# EAGLE design RP_MODE01 (EAGLE 9.6.2)
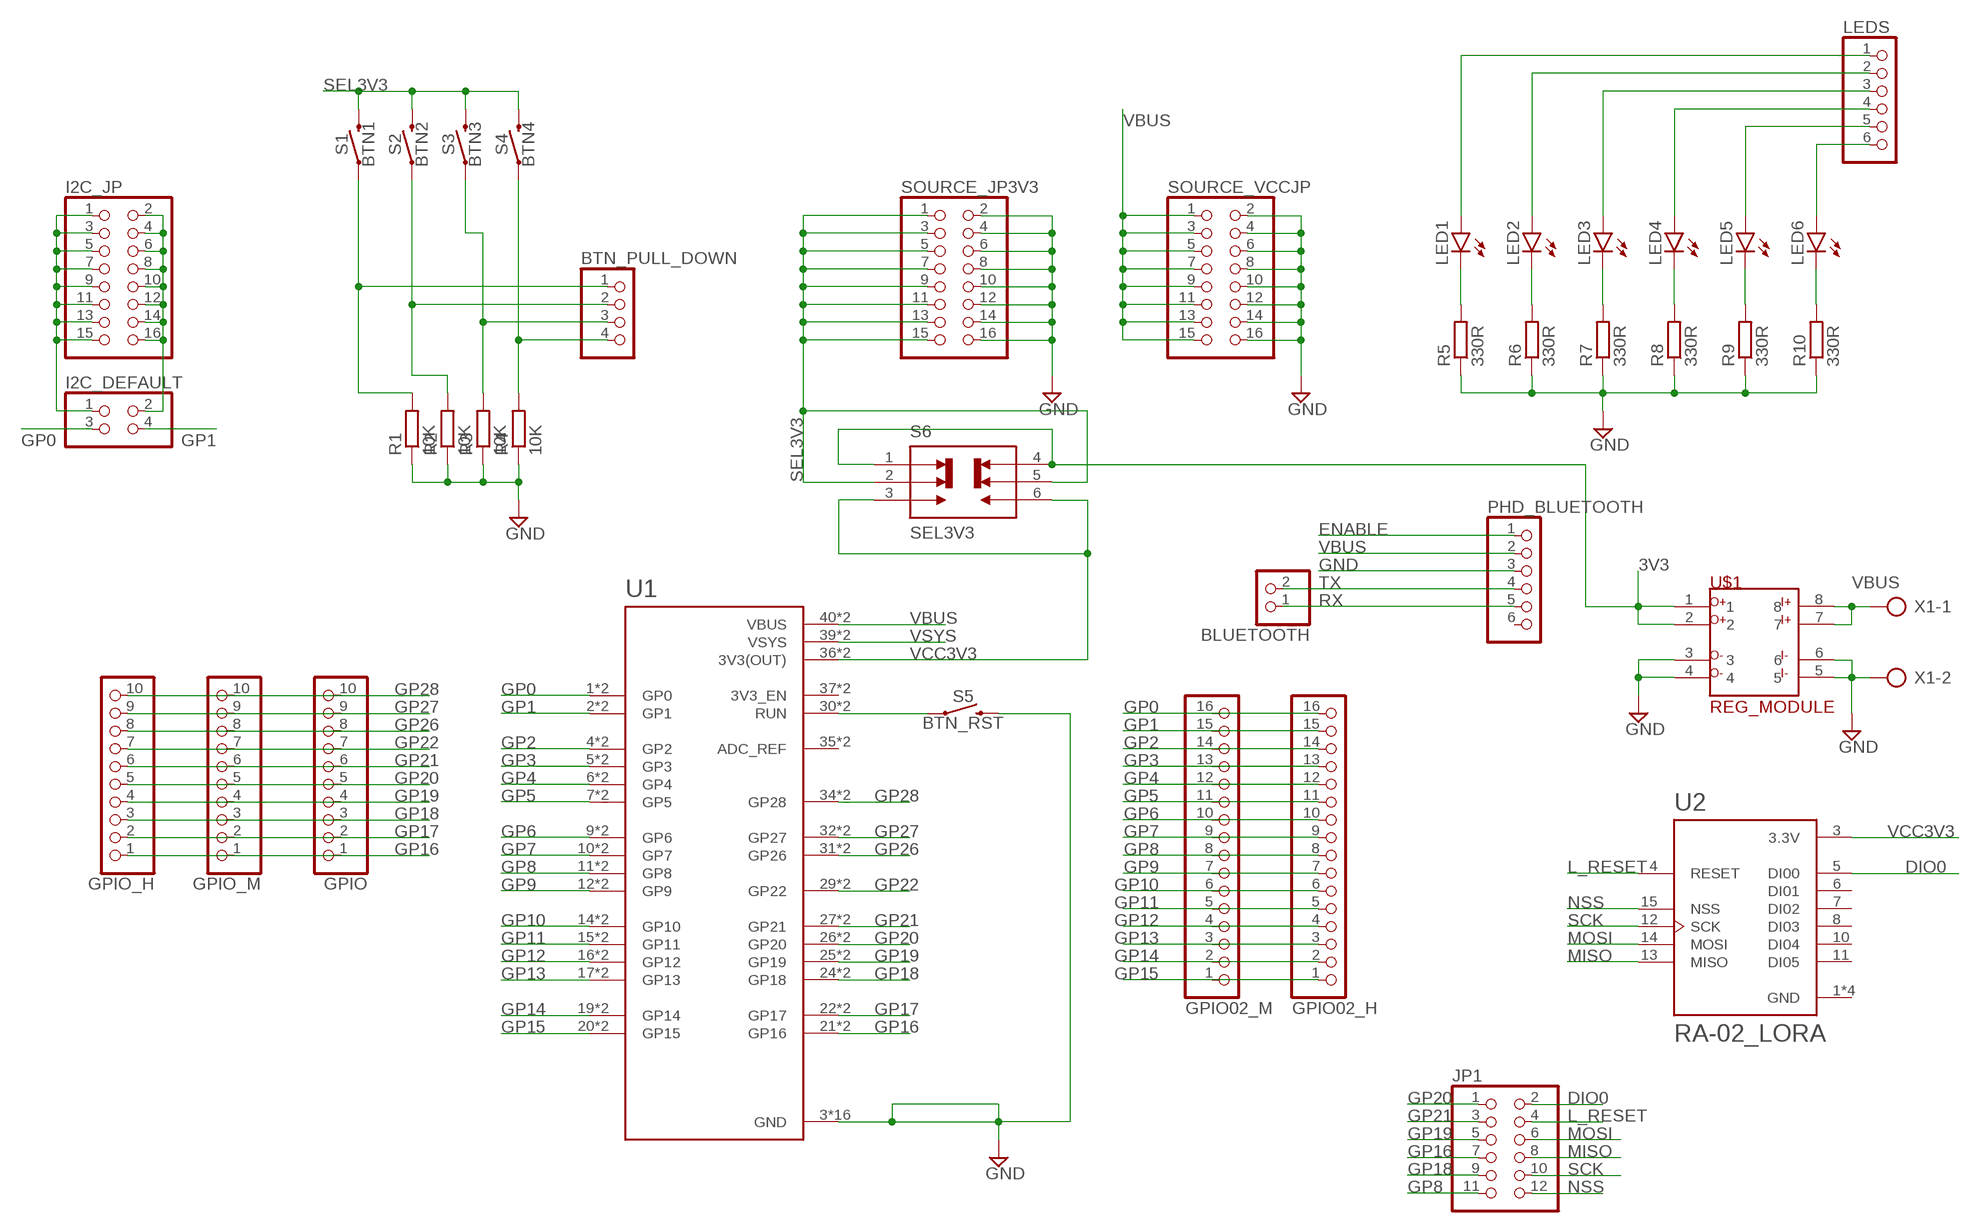
[diagram p0: schematic, sheet 1]

## Parts
BLUETOOTH  PINHD-1X2  [1X02]
BTN_PULL_DOWN  PINHD-1X4  [1X04]
GPIO  PINHD-1X10  [1X10]
GPIO02_H  PINHD-1X16  [1X16]
GPIO02_M  PINHD-1X16  [1X16]
GPIO_H  PINHD-1X10  [1X10]
GPIO_M  PINHD-1X10  [1X10]
I2C_DEFAULT  PINHD-2X2  [2X02]
I2C_JP  PINHD-2X8  [2X08]
JP1  PINHD-2X6  [2X06]
LED1  LEDCHIP-LED0805  [CHIP-LED0805]
LED2  LEDCHIP-LED0805  [CHIP-LED0805]
LED3  LEDCHIP-LED0805  [CHIP-LED0805]
LED4  LEDCHIP-LED0805  [CHIP-LED0805]
LED5  LEDCHIP-LED0805  [CHIP-LED0805]
LED6  LEDCHIP-LED0805  [CHIP-LED0805]
LEDS  PINHD-1X6  [1X06]
PHD_BLUETOOTH  PINHD-1X6  [1X06]
R1  10K  R-EU_R0805  [R0805]
R2  10K  R-EU_R0805  [R0805]
R3  10K  R-EU_R0805  [R0805]
R4  10K  R-EU_R0805  [R0805]
R5  330R  R-EU_R0805  [R0805]
R6  330R  R-EU_R0805  [R0805]
R7  330R  R-EU_R0805  [R0805]
R8  330R  R-EU_R0805  [R0805]
R9  330R  R-EU_R0805  [R0805]
R10  330R  R-EU_R0805  [R0805]
S1  BTN1  PTS636SM25FSMTRLFS-SMD-6.0X3.5MM  [TACTILE_SWITCH_SMD_6.0X3.5MM]
S2  BTN2  PTS636SM25FSMTRLFS-SMD-6.0X3.5MM  [TACTILE_SWITCH_SMD_6.0X3.5MM]
S3  BTN3  PTS636SM25FSMTRLFS-SMD-6.0X3.5MM  [TACTILE_SWITCH_SMD_6.0X3.5MM]
S4  BTN4  PTS636SM25FSMTRLFS-SMD-6.0X3.5MM  [TACTILE_SWITCH_SMD_6.0X3.5MM]
S5  BTN_RST  PTS636SM25FSMTRLFS-SMD-6.0X3.5MM  [TACTILE_SWITCH_SMD_6.0X3.5MM]
S6  SEL3V3  JS202011SCQN  [SW_JS202011SCQN]
SOURCE_JP3V3  PINHD-2X8  [2X08]
SOURCE_VCCJP  PINHD-2X8  [2X08]
U1  RASPBERRY_PICO-NO_DEBUG  [PICO-PKG-NO_DEBUG]
U2  RA-02_LORA  [MODULE_RA-02_LORA]
U$1  REG_MODULE  [REG_MODULE]
X1  AK300/2  [AK300/2]

## Nets
3V3: S6.1 S6.4 U$1.1 U$1.2
DIO0: JP1.2 U2.5(DI00)
ENABLE: PHD_BLUETOOTH.1
GND: PHD_BLUETOOTH.3 R1.1 R2.1 R3.1 R4.1 R5.1 R6.1 R7.1 R8.1 R9.1 R10.1 S5.2 SOURCE_JP3V3.2 SOURCE_JP3V3.4 SOURCE_JP3V3.6 SOURCE_JP3V3.8 SOURCE_JP3V3.10 SOURCE_JP3V3.12 SOURCE_JP3V3.14 SOURCE_JP3V3.16 SOURCE_VCCJP.2 SOURCE_VCCJP.4 SOURCE_VCCJP.6 SOURCE_VCCJP.8 SOURCE_VCCJP.10 SOURCE_VCCJP.12 SOURCE_VCCJP.14 SOURCE_VCCJP.16 U1.3(GND) U1.8(GND) U1.13(GND) U1.18(GND) U1.23(GND) U1.28(GND) U1.33(GND) U1.38(GND) U1.P$3(GND) U1.P$8(GND) U1.P$13(GND) U1.P$18(GND) U1.P$23(GND) U1.P$28(GND) U1.P$33(GND) U1.P$38(GND) U$1.3 U$1.4 U$1.5 U$1.6 X1.2
GP0: GPIO02_H.16 GPIO02_M.16 I2C_DEFAULT.3 U1.1(GP0) U1.P$1(GP0)
GP1: GPIO02_H.15 GPIO02_M.15 I2C_DEFAULT.4 U1.2(GP1) U1.P$2(GP1)
GP2: GPIO02_H.14 GPIO02_M.14 U1.4(GP2) U1.P$4(GP2)
GP3: GPIO02_H.13 GPIO02_M.13 U1.5(GP3) U1.P$5(GP3)
GP4: GPIO02_H.12 GPIO02_M.12 U1.6(GP4) U1.P$6(GP4)
GP5: GPIO02_H.11 GPIO02_M.11 U1.7(GP5) U1.P$7(GP5)
GP6: GPIO02_H.10 GPIO02_M.10 U1.9(GP6) U1.P$9(GP6)
GP7: GPIO02_H.9 GPIO02_M.9 U1.10(GP7) U1.P$10(GP7)
GP8: GPIO02_H.8 GPIO02_M.8 JP1.11 U1.11(GP8) U1.P$11(GP8)
GP9: GPIO02_H.7 GPIO02_M.7 U1.12(GP9) U1.P$12(GP9)
GP10: GPIO02_H.6 GPIO02_M.6 U1.14(GP10) U1.P$14(GP10)
GP11: GPIO02_H.5 GPIO02_M.5 U1.15(GP11) U1.P$15(GP11)
GP12: GPIO02_H.4 GPIO02_M.4 U1.16(GP12) U1.P$16(GP12)
GP13: GPIO02_H.3 GPIO02_M.3 U1.17(GP13) U1.P$17(GP13)
GP14: GPIO02_H.2 GPIO02_M.2 U1.19(GP14) U1.P$19(GP14)
GP15: GPIO02_H.1 GPIO02_M.1 U1.20(GP15) U1.P$20(GP15)
GP16: GPIO.1 GPIO_H.1 GPIO_M.1 JP1.7 U1.21(GP16) U1.P$21(GP16)
GP17: GPIO.2 GPIO_H.2 GPIO_M.2 U1.22(GP17) U1.P$22(GP17)
GP18: GPIO.3 GPIO_H.3 GPIO_M.3 JP1.9 U1.24(GP18) U1.P$24(GP18)
GP19: GPIO.4 GPIO_H.4 GPIO_M.4 JP1.5 U1.25(GP19) U1.P$25(GP19)
GP20: GPIO.5 GPIO_H.5 GPIO_M.5 JP1.1 U1.26(GP20) U1.P$26(GP20)
GP21: GPIO.6 GPIO_H.6 GPIO_M.6 JP1.3 U1.27(GP21) U1.P$27(GP21)
GP22: GPIO.7 GPIO_H.7 GPIO_M.7 U1.29(GP22) U1.P$29(GP22)
GP26: GPIO.8 GPIO_H.8 GPIO_M.8 U1.31(GP26) U1.P$31(GP26)
GP27: GPIO.9 GPIO_H.9 GPIO_M.9 U1.32(GP27) U1.P$32(GP27)
GP28: GPIO.10 GPIO_H.10 GPIO_M.10 U1.34(GP28) U1.P$34(GP28)
L_RESET: JP1.4 U2.4(RESET)
MISO: JP1.8 U2.13(MISO)
MOSI: JP1.6 U2.14(MOSI)
N$1: BTN_PULL_DOWN.1 R1.2 S1.1
N$2: BTN_PULL_DOWN.2 R2.2 S2.1
N$3: BTN_PULL_DOWN.3 R3.2 S3.1
N$4: BTN_PULL_DOWN.4 R4.2 S4.1
N$5: S5.1 U1.30(RUN) U1.P$30(RUN)
N$6: LED2.A LEDS.2
N$7: LED3.A LEDS.3
N$8: LED1.C R5.2
N$9: LED2.C R6.2
N$10: LED3.C R7.2
N$11: LED4.C R8.2
N$12: LED5.C R9.2
N$13: LED6.C R10.2
N$14: LED6.A LEDS.6
N$15: LED1.A LEDS.1
N$16: LED4.A LEDS.4
N$17: LED5.A LEDS.5
NSS: JP1.12 U2.15(NSS)
RX: BLUETOOTH.1 PHD_BLUETOOTH.5
SCK: JP1.10 U2.12(SCK)
SCL: I2C_DEFAULT.2 I2C_JP.2 I2C_JP.4 I2C_JP.6 I2C_JP.8 I2C_JP.10 I2C_JP.12 I2C_JP.14 I2C_JP.16
SDA: I2C_DEFAULT.1 I2C_JP.1 I2C_JP.3 I2C_JP.5 I2C_JP.7 I2C_JP.9 I2C_JP.11 I2C_JP.13 I2C_JP.15
SEL3V3: S1.2 S2.2 S3.2 S4.2 S6.2 S6.5 SOURCE_JP3V3.1 SOURCE_JP3V3.3 SOURCE_JP3V3.5 SOURCE_JP3V3.7 SOURCE_JP3V3.9 SOURCE_JP3V3.11 SOURCE_JP3V3.13 SOURCE_JP3V3.15
TX: BLUETOOTH.2 PHD_BLUETOOTH.4
VBUS: PHD_BLUETOOTH.2 SOURCE_VCCJP.1 SOURCE_VCCJP.3 SOURCE_VCCJP.5 SOURCE_VCCJP.7 SOURCE_VCCJP.9 SOURCE_VCCJP.11 SOURCE_VCCJP.13 SOURCE_VCCJP.15 U1.40(VBUS) U1.P$40(VBUS) U$1.7 U$1.8 X1.1
VCC3V3: S6.3 S6.6 U1.36(3V3(OUT)) U1.P$36(3V3(OUT)) U2.3(3.3V)
VSYS: U1.39(VSYS) U1.P$39(VSYS)
Unconnected: PHD_BLUETOOTH.6 U1.35(ADC_REF) U1.37(3V3_EN) U1.P$35(ADC_REF) U1.P$37(3V3_EN) U2.6(DI01) U2.7(DI02) U2.8(DI03) U2.10(DI04) U2.11(DI05)

## Power pins joined to a net without a drawn wire
GND: U2.1(GND) U2.2(GND) U2.9(GND) U2.16(GND)

## Library data of the parts
BLUETOOTH = pinhead:PINHD-1X2: PIN HEADER
BTN_PULL_DOWN = pinhead:PINHD-1X4: PIN HEADER
GPIO GPIO_H GPIO_M = pinhead:PINHD-1X10: PIN HEADER
GPIO02_H GPIO02_M = pinhead:PINHD-1X16: PIN HEADER
I2C_DEFAULT = pinhead:PINHD-2X2: PIN HEADER
I2C_JP SOURCE_JP3V3 SOURCE_VCCJP = pinhead:PINHD-2X8: PIN HEADER
JP1 = pinhead:PINHD-2X6: PIN HEADER
LED1-LED6 = led:LED: LED OSRAM: - CHIPLED LG R971, LG N971, LY N971, LG Q971, LY Q971, LO R971, LY R971 LH N974, LH R974 LS Q976, LO Q976, LY Q976 LO Q996 - Hyper CHIPLED LW Q18S LB Q993, LB Q99A, LB R99A - SideLED LS A670, LO A670, LY A670, LG A670, LP A670 LB A673, LV A673, LT A673, LW A673 LH A674 LY A675 LS A676, LA A676, LO A676, LY A676, LW A676 LS A679, LY A679, LG A679 - Hyper Micro SIDELED® LS Y876, LA Y876, LO Y876, LY Y876 LT Y87S - SmartLED LW L88C, LW L88S LB L89C, LB L89S, LG L890 LS L89K, LO L89K, LY L89K LS L896, LA L896, LO L896, LY L896 - TOPLED LS T670, LO T670, LY T670, LG T670, LP T670 LSG T670, LSP T670, LSY T670, LOP T670, LYG T670 LG T671, LOG T671, LSG T671 LB T673, LV T673, LT T673, LW T673 LH T674 LS T676, LA T676, LO T676, LY T676, LB T676, LH T676, LSB T676, LW T676 LB T67C, LV T67C, LT T67C, LS T67K, LO T67K, LY T67K, LW E67C LS E67B, LA E67B, LO E67B, LY E67B, LB E67C, LV E67C, LT E67C LW T67C LS T679, LY T679, LG T679 LS T770, LO T770, LY T770, LG T770, LP T770 LB T773, LV T773, LT T773, LW T773 LH T774 LS E675, LA E675, LY E675, LS T675 LS T776, LA T776, LO T776, LY T776, LB T776 LHGB T686 LT T68C, LB T68C - Hyper Mini TOPLED® LB M676 - Mini TOPLED Santana® LG M470 LS M47K, LO M47K, LY M47K Source: http://www.osram.convergy.de LUXEON: - LUMILED® LXK2-PW12-R00, LXK2-PW12-S00, LXK2-PW14-U00, LXK2-PW14-V00 LXK2-PM12-R00, LXK2-PM12-S00, LXK2-PM14-U00 LXK2-PE12-Q00, LXK2-PE12-R00, LXK2-PE12-S00, LXK2-PE14-T00, LXK2-PE14-U00 LXK2-PB12-K00, LXK2-PB12-L00, LXK2-PB12-M00, LXK2-PB14-N00, LXK2-PB14-P00, LXK2-PB14-Q00 LXK2-PR12-L00, LXK2-PR12-M00, LXK2-PR14-Q00, LXK2-PR14-R00 LXK2-PD12-Q00, LXK2-PD12-R00, LXK2-PD12-S00 LXK2-PH12-R00, LXK2-PH12-S00 LXK2-PL12-P00, LXK2-PL12-Q00, LXK2-PL12-R00 Source: www.luxeon.com KINGBRIGHT: KA-3528ASYC Source: www.kingbright.com
LEDS PHD_BLUETOOTH = pinhead:PINHD-1X6: PIN HEADER
R1-R10 = mi_rcl:R-EU_: RESISTOR, European symbol; SPICEPREFIX: R
S1-S5 = PTS636SM25FSMTRLFS:PTS636SM25FSMTRLFS: Momentary Switch (Pushbutton) - SPST Tactile Switch SPST-NO Top Actuated Surface Mount . Variants PTS636 SM25F SMTR LFS Momentary Pushbutton Switch - 12mm Square <https://www.snapeda.com/parts/PTS636%20SM25F%20SMTR%20LFS/C&K/datasheet/> PTS636 SM25F SMTR LFS Check availability <https://pricing.snapeda.com/parts/PTS636SM25FSMTRLFS/CK/view-part?ref=eda>; AVAILABILITY: In Stock; DESCRIPTION: Switch Tactile N.O. SPST Rectangular Button F-Lead 0.05A 12VDC 1.77N SMD T/R; MF: CK; MP: PTS636SM25FSMTRLFS; PACKAGE: None; PRICE: None
S6 = JS202011SCQN:JS202011SCQN: Check availability <https://pricing.snapeda.com/parts/JS202011SCQN/C%26K/view-part?ref=eda>; AVAILABILITY: In Stock; DESCRIPTION: Slide Switch DPDT Surface Mount; MF: C&K; MP: JS202011SCQN; PACKAGE: None; PRICE: None; PURCHASE-URL: https://pricing.snapeda.com/search?q=JS202011SCQN&ref=eda
U1 = RpiPico:RASPBERRY_PICO-NO_DEBUG
U2 = RA-02_LORA:RA-02_LORA: Ra-02 LoRa RF M5Stack Platform Evaluation Expansion Board Check availability <https://pricing.snapeda.com/parts/Ra-02%20LoRa/AI-Thinker/view-part?ref=eda>; AVAILABILITY: Not in stock; CHECK_PRICES: https://www.snapeda.com/parts/Ra-02%20LoRa/AI-Thinker/view-part/?ref=eda; DESCRIPTION: Ra-02 LoRa RF M5Stack Platform Evaluation Expansion Board; MF: AI-Thinker; MP: Ra-02 LoRa; PACKAGE: None; PRICE: None; SNAPEDA_LINK: https://www.snapeda.com/parts/Ra-02%20LoRa/AI-Thinker/view-part/?ref=snap
U$1 = REG_MODULE:REG_MODULE
X1 = con-ptr500:AK300/2: CONNECTOR; OC_FARNELL: unknown; OC_NEWARK: unknown

## Board
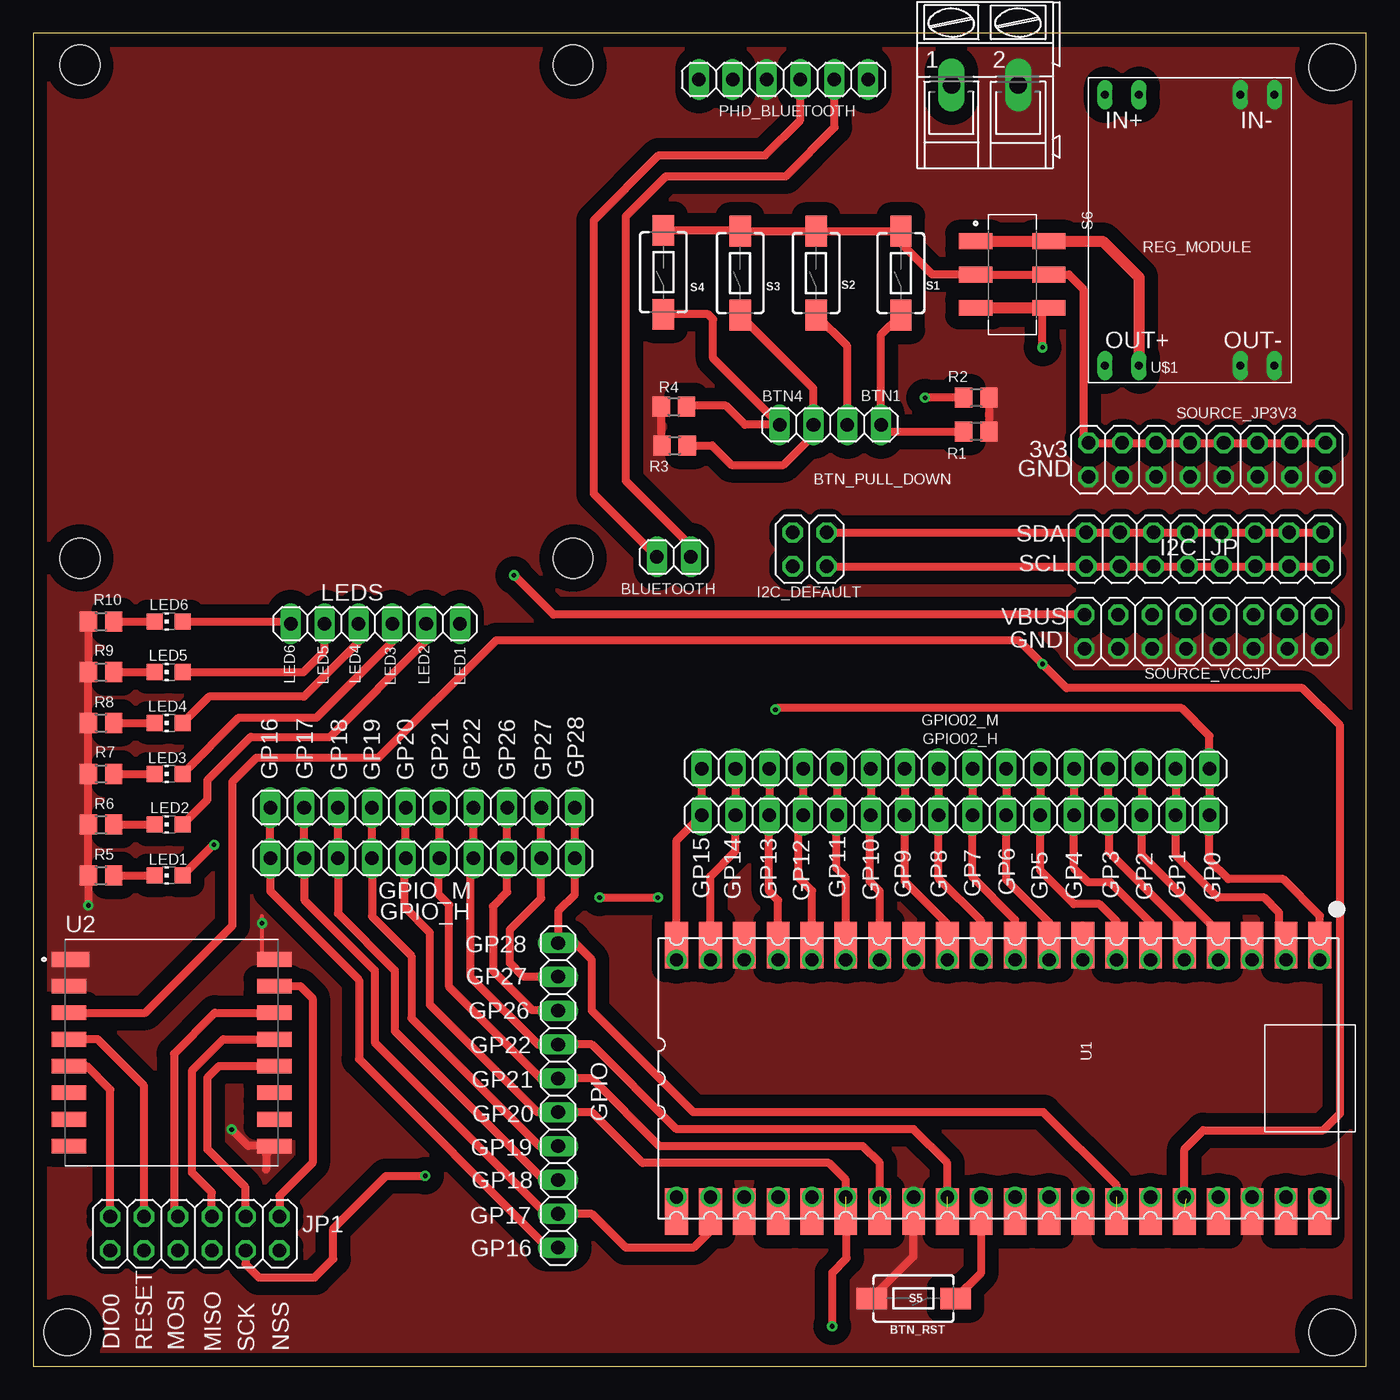
[diagram p1: board, top side]
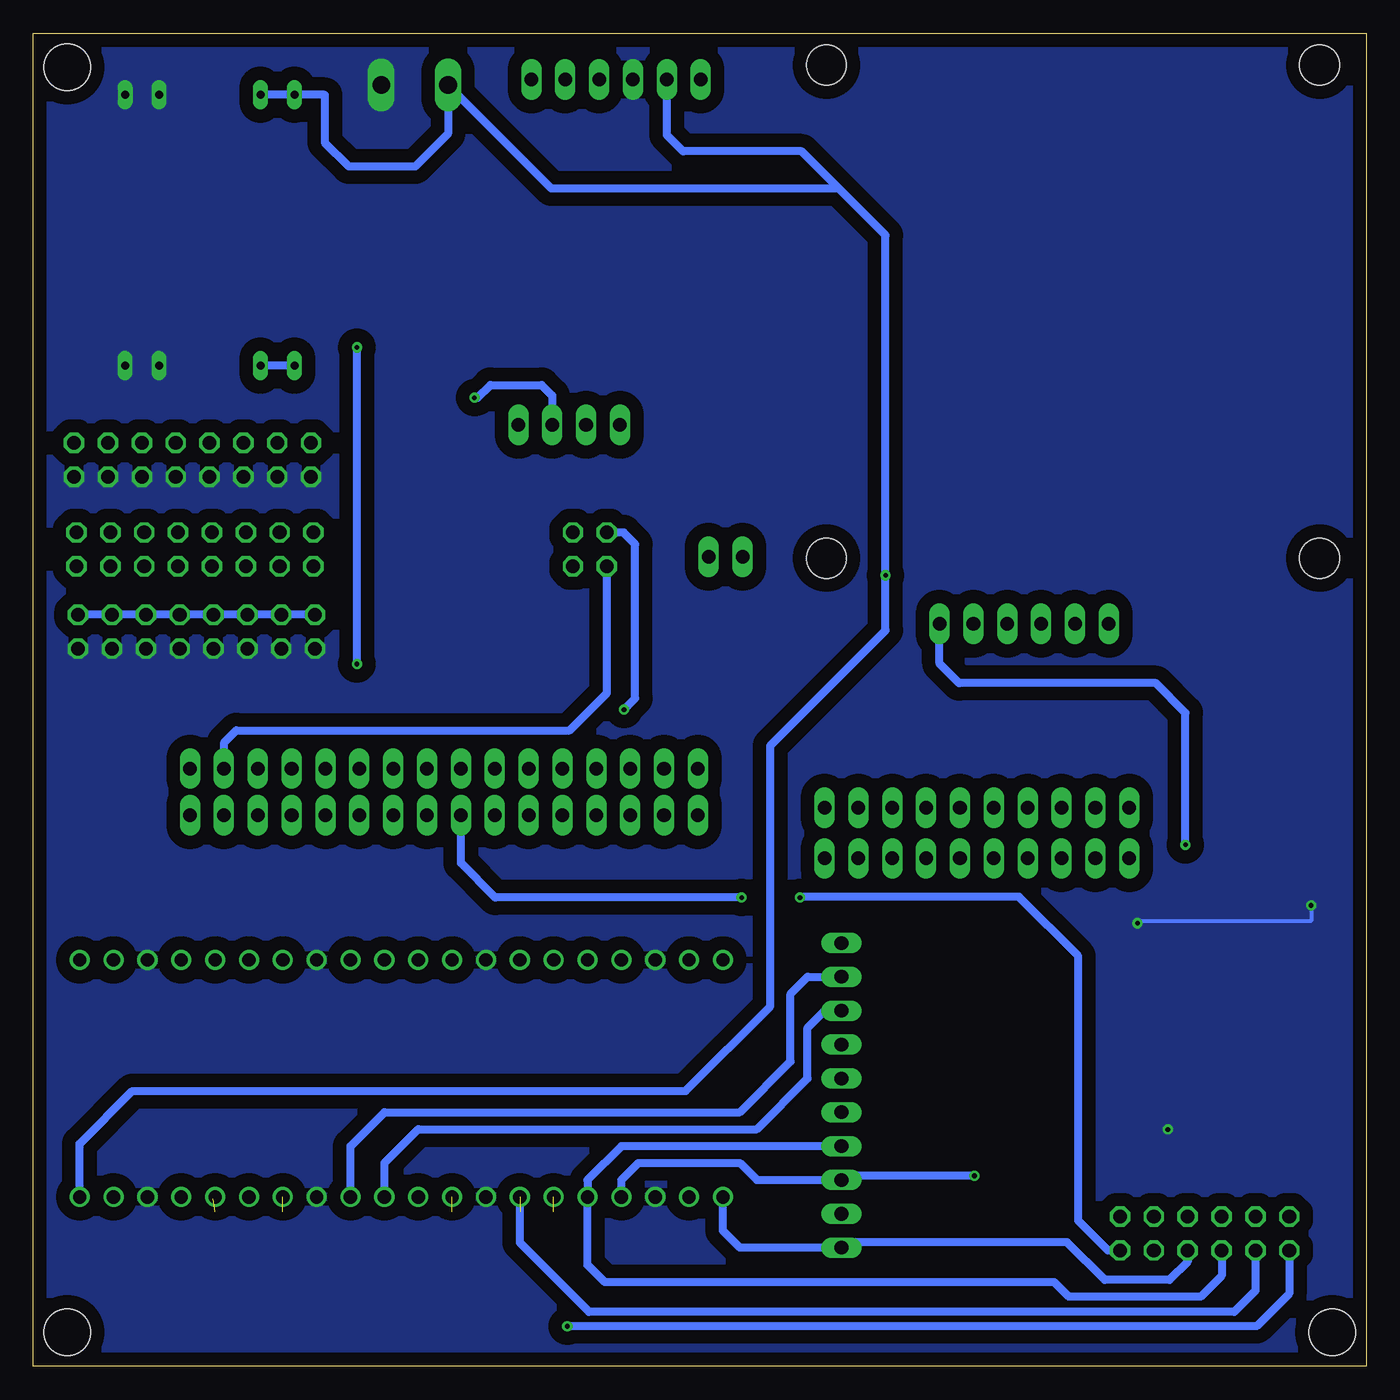
[diagram p2: board, bottom side, seen from below]

Size 100 x 100 mm. Coordinates in mm from the lower left corner, seen from the top.
Outline: 0,0 100,0 100,100 0,100 0,0
Copper layers (1*16): Top 0.035mm / dielectric 1.5mm / Bottom 0.035mm
Design rules "default *": minimum track width 6mil, minimum drill 0.35mm, track to track 6mil, track to pad 6mil, pad to pad 6mil, via to via 6mil, smd to smd 6mil, copper to edge 40mil, drill to drill 6mil, minimum pad ring 10mil, minimum via ring 8mil, stop-mask expansion 4mil, vias tented up to drill 0mil, thermal gap 0mil
Holes 3.5 mm at 2.54,2.54 97.46,2.54 97.46,97.46
Holes 3 mm at 3.49,97.62 3.49,60.62 40.49,97.62 40.49,60.62

### Footprints (pad centres in the part's own frame; a part is rotated, then mirrored left to right if it is on the bottom)
1X02 = drill 1.016 long: 1 -1.27,0; 2 1.27,0
1X04 = drill 1.016 long: 1 -3.81,0; 2 -1.27,0; 3 1.27,0; 4 3.81,0
1X10 = drill 1.016 long: 1 -11.43,0; 2 -8.89,0; 3 -6.35,0; 4 -3.81,0; 5 -1.27,0; 6 1.27,0; 7 3.81,0; 8 6.35,0; 9 8.89,0; 10 11.43,0
1X16 = drill 1.016 long: 1 -19.05,0; 2 -16.51,0; 3 -13.97,0; 4 -11.43,0; 5 -8.89,0; 6 -6.35,0; 7 -3.81,0; 8 -1.27,0; 9 1.27,0; 10 3.81,0; 11 6.35,0; 12 8.89,0; 13 11.43,0; 14 13.97,0; 15 16.51,0; 16 19.05,0
2X02 = drill 1.016 octagon: 1 -1.27,-1.27; 2 -1.27,1.27; 3 1.27,-1.27; 4 1.27,1.27
2X08 = drill 1.016 octagon: 1 -8.89,-1.27; 2 -8.89,1.27; 3 -6.35,-1.27; 4 -6.35,1.27; 5 -3.81,-1.27; 6 -3.81,1.27; 7 -1.27,-1.27; 8 -1.27,1.27; 9 1.27,-1.27; 10 1.27,1.27; 11 3.81,-1.27; 12 3.81,1.27; 13 6.35,-1.27; 14 6.35,1.27; 15 8.89,-1.27; 16 8.89,1.27
2X06 = drill 1.016 octagon: 1 -6.35,-1.27; 2 -6.35,1.27; 3 -3.81,-1.27; 4 -3.81,1.27; 5 -1.27,-1.27; 6 -1.27,1.27; 7 1.27,-1.27; 8 1.27,1.27; 9 3.81,-1.27; 10 3.81,1.27; 11 6.35,-1.27; 12 6.35,1.27
CHIP-LED0805 = smd 1.2 x 1.2: A 0,-1.05; C 0,1.05
1X06 = drill 1.016 long: 1 -6.35,0; 2 -3.81,0; 3 -1.27,0; 4 1.27,0; 5 3.81,0; 6 6.35,0
R0805 = smd 1.3 x 1.5: 1 -0.95,0; 2 0.95,0
TACTILE_SWITCH_SMD_6.0X3.5MM = smd 2.3 x 1.6: 1 -3.15,0; 2 3.15,0
SW_JS202011SCQN = smd 1.2 x 2.5: 1 -2.5,-2.75; 2 0,-2.75; 3 2.5,-2.75; 4 -2.5,2.75; 5 0,2.75; 6 2.5,2.75
PICO-PKG-NO_DEBUG = drill 1: 1 -7.62,25.4; 2 -7.62,22.86; 3 -7.62,20.32; 4 -7.62,17.78; 5 -7.62,15.24; 6 -7.62,12.7; 7 -7.62,10.16; 8 -7.62,7.62; 9 -7.62,5.08; 10 -7.62,2.54; 11 -7.62,0; 12 -7.62,-2.54; 13 -7.62,-5.08; 14 -7.62,-7.62; 15 -7.62,-10.16; 16 -7.62,-12.7; 17 -7.62,-15.24; 18 -7.62,-17.78; 19 -7.62,-20.32; 20 -7.62,-22.86; 21 10.16,-22.86; 22 10.16,-20.32; 23 10.16,-17.78; 24 10.16,-15.24; 25 10.16,-12.7; 26 10.16,-10.16; 27 10.16,-7.62; 28 10.16,-5.08; 29 10.16,-2.54; 30 10.16,0; 31 10.16,2.54; 32 10.16,5.08; 33 10.16,7.62; 34 10.16,10.16; 35 10.16,12.7; 36 10.16,15.24; 37 10.16,17.78; 38 10.16,20.32; 39 10.16,22.86; 40 10.16,25.4 | smd 3.5 x 1.7: P$1 -8.73,25.4; P$2 -8.73,22.86; P$3 -8.73,20.32; P$4 -8.73,17.78; P$5 -8.73,15.24; P$6 -8.73,12.7; P$7 -8.73,10.16; P$8 -8.73,7.62; P$9 -8.73,5.08; P$10 -8.73,2.54; P$11 -8.73,0; P$12 -8.73,-2.54; P$13 -8.73,-5.08; P$14 -8.73,-7.62; P$15 -8.73,-10.16; P$16 -8.73,-12.7; P$17 -8.73,-15.24; P$18 -8.73,-17.78; P$19 -8.73,-20.32; P$20 -8.73,-22.86; P$21 11.27,-22.86; P$22 11.27,-20.32; P$23 11.27,-17.78; P$24 11.27,-15.24; P$25 11.27,-12.7; P$26 11.27,-10.16; P$27 11.27,-7.62; P$28 11.27,-5.08; P$29 11.27,-2.54; P$30 11.27,0; P$31 11.27,2.54; P$32 11.27,5.08; P$33 11.27,7.62; P$34 11.27,10.16; P$35 11.27,12.7; P$36 11.27,15.24; P$37 11.27,17.78; P$38 11.27,20.32; P$39 11.27,22.86; P$40 11.27,25.4
MODULE_RA-02_LORA = smd 2.8 x 1.1: 1 -7.6,7 | smd 2.6 x 1.1: 2 -7.7,5; 3 -7.7,3; 4 -7.7,1; 5 -7.7,-1; 6 -7.7,-3; 7 -7.7,-5; 8 -7.7,-7; 9 7.7,-7; 10 7.7,-5; 11 7.7,-3; 12 7.7,-1; 13 7.7,1; 14 7.7,3; 15 7.7,5; 16 7.7,7
REG_MODULE = drill 0.6 long: 1 1.27,1.27; 2 3.81,1.27; 3 11.43,1.27; 4 13.97,1.27; 5 13.97,21.59; 6 11.43,21.59; 7 3.81,21.59; 8 1.27,21.59
AK300/2 = drill 1.321 long: 1 -2.515,0; 2 2.489,0

### Placement (x,y rotation side)
BLUETOOTH  48.06,60.72 180 top
BTN_PULL_DOWN  59.8,70.63 180 top
GPIO  39.37,20.32 90 top
GPIO02_H  69.19,41.33 0 top
GPIO02_M  69.19,44.84 0 top
GPIO_H  29.21,38.1 0 top
GPIO_M  29.21,41.91 0 top
I2C_DEFAULT  58.24,61.28 180 top
I2C_JP  87.87,61.28 180 top
JP1  12.12,9.96 0 top
LED1  10.16,36.83 90 top
LED2  10.16,40.64 90 top
LED3  10.16,44.45 90 top
LED4  10.16,48.26 90 top
LED5  10.16,52.07 90 top
LED6  10.16,55.88 90 top
LEDS  25.66,55.7 180 top
PHD_BLUETOOTH  56.28,96.54 0 top
R1  70.74,70.13 180 top
R2  70.74,72.65 180 top
R3  48.12,69.07 0 top
R4  48.06,72.01 0 top
R5  5.08,36.83 0 top
R6  5.08,40.64 0 top
R7  5.08,44.45 0 top
R8  5.08,48.26 0 top
R9  5.08,52.07 0 top
R10  5.08,55.88 0 top
S1  65.09,82.01 90 top
S2  58.73,82.01 90 top
S3  53.03,82.01 90 top
S4  47.27,82.07 90 top
S5  66.04,5.08 180 top
S6  73.44,81.9 270 top
SOURCE_JP3V3  88.05,68 180 top
SOURCE_VCCJP  87.75,55.11 180 top
U1  71.12,22.86 270 top
U2  10.38,23.52 0 top
U$1  79.14,73.8 0 top
X1  71.4,96.12 0 top

### Tracks (layer width: path | path; a pad name or v marks a point on that pad's centre or on a via)
3V3
  Top 0.813: S6.1 S6.4 80.24,84.4 82.95,81.69 U$1.2
  Bottom 0.61: U$1.1 U$1.2
DIO0
  Top 0.61: JP1.2 5.77,20.75 4,22.52 U2.5
GND  (via drill 0.35)
  Top 0.305: U2.16 17.16,30.52 v17.16,33.24 17.16,33.78
  Top 0.61: S5.2 66.04,8.23 U1.28 U1.P$28 | R10.1 R9.1 R8.1 R7.1 R6.1 R5.1 v4.13,34.57 | R2.1 R1.1 | R4.1 47.11,69.13 R3.1 | U1.P$18 U1.18 | U1.P$13 U1.13 | U1.P$8 U1.8 | U1.P$3 U1.3 | U1.P$23 U1.23 | U1.P$33 U1.33 | U1.P$38 U1.38 | 17.46,14.76 17.46,15.9 U2.9 16.12,16.52 v14.88,17.76
  Bottom 0.305: v4.13,34.57 4.13,33.42 16.98,33.42 v17.16,33.24
  pour Bottom (isolate 1.016): 0,0 100,0 100,100 0,100
  pour Top (isolate 1.016): 0.42,0.36 99.54,0.36 99.54,99.24 0.42,99.24
GP0  (via drill 0.35)
  Top 0.61: v55.68,49.26 55.8,49.38 86.16,49.38 88.24,47.3 GPIO02_M.16 GPIO02_H.16 88.24,37.94 89.64,36.54 93.78,36.54 96.52,33.8 U1.P$1 U1.1
  Bottom 0.61: v55.68,49.26 54.84,50.1 54.84,61.68 55.71,62.55 I2C_DEFAULT.3
GP1
  Top 0.61: GPIO02_M.15 GPIO02_H.15 85.7,38.32 88.86,35.16 92.34,35.16 93.48,34.02 93.48,32.09 U1.P$2 U1.2
  Bottom 0.61: GPIO02_M.15 85.68,44.86 85.68,46.8 84.78,47.7 59.76,47.7 56.97,50.49 I2C_DEFAULT.4
GP2
  Top 0.61: GPIO02_M.14 GPIO02_H.14 83.16,38.34 88.9,32.6 U1.P$4 U1.4
GP3
  Top 0.61: GPIO02_M.13 GPIO02_H.13 80.68,41.27 80.68,38.6 86.36,32.92 U1.P$5 U1.5
GP4
  Top 0.61: GPIO02_M.12 GPIO02_H.12 78.08,37.36 79.14,36.3 80.82,36.3 83.82,33.3 U1.P$6 U1.6
GP5
  Top 0.61: GPIO02_M.11 GPIO02_H.11 75.54,37.2 78.06,34.68 79.98,34.68 81.28,33.38 U1.P$7 U1.7
GP6
  Top 0.61: GPIO02_M.10 GPIO02_H.10 73,36.5 76.2,33.3 U1.P$9 U1.9
GP7
  Top 0.61: GPIO02_M.9 GPIO02_H.9 70.46,36.7 73.66,33.5 U1.P$10 U1.10
GP8  (via drill 0.35)
  Top 0.61: GPIO02_M.8 GPIO02_H.8 67.92,36.6 71.12,33.4 U1.P$11 U1.11 | v42.48,35.16 v46.86,35.16
  Bottom 0.61: JP1.11 19.37,8.69 21.6,10.92 21.6,30.78 26.04,35.22 42.42,35.22 v42.48,35.16 | v46.86,35.16 65.34,35.16 67.92,37.74 GPIO02_H.8
GP9
  Top 0.61: GPIO02_M.7 GPIO02_H.7 65.38,36.38 68.58,33.18 U1.P$12 U1.12
GP10
  Top 0.61: GPIO02_M.6 GPIO02_H.6 62.76,41.25 62.76,36.36 63.5,35.62 U1.P$14 U1.14
GP11
  Top 0.61: GPIO02_M.5 GPIO02_H.5 60.24,41.27 60.24,37.38 60.96,36.66 U1.P$15 U1.15
GP12
  Top 0.61: GPIO02_M.4 GPIO02_H.4 57.42,40.99 57.42,36.66 58.42,35.66 U1.P$16 U1.16
GP13
  Top 0.61: GPIO02_M.3 GPIO02_H.3 55.2,41.31 55.2,35.64 55.88,34.96 U1.P$17 U1.17
GP14
  Top 0.61: GPIO02_M.2 GPIO02_H.2 52.68,38.64 50.8,36.76 U1.P$19 U1.19
GP15
  Top 0.61: GPIO02_M.1 GPIO02_H.1 48.26,39.45 U1.P$20 U1.20
GP16
  Top 0.61: GPIO.1 39.25,8.77 38.71,8.77 24.44,23.04 24.44,28.98 17.78,35.64 GPIO_H.1 GPIO_M.1 | U1.P$21 U1.21
  Bottom 0.61: U1.21 48.26,10.16 46.99,8.89 GPIO.1 38.96,9.3 22.44,9.3 19.62,6.48 14.76,6.48 13.39,7.85 JP1.7
GP17
  Top 0.61: GPIO_M.2 GPIO_H.2 20.32,35 25.62,29.7 25.62,24.3 38.37,11.55 39.25,11.55 GPIO.2 41.91,11.43 44.45,8.89 49.53,8.89 50.8,10.16 U1.P$22 U1.22
GP18  (via drill 0.35)
  Top 0.61: GPIO.3 38.29,13.97 27.12,25.14 27.12,29.7 22.86,33.96 GPIO_H.3 GPIO_M.3 | JP1.9 15.93,7.65 16.92,6.66 21.12,6.66 22.5,8.04 22.5,10.32 26.46,14.28 v29.4,14.28 | U1.P$24 U1.24
  Bottom 0.61: U1.24 55.88,13.97 54.61,15.24 46.99,15.24 45.72,13.97 GPIO.3 39.06,14.28 v29.4,14.28
GP19
  Top 0.61: GPIO.4 37.97,16.51 28.38,26.1 28.38,30.78 25.4,33.76 GPIO_H.4 GPIO_M.4 | U1.P$25 U1.25
  Bottom 0.61: GPIO.4 55.88,16.51 58.42,13.97 U1.25 58.42,7.6 57.12,6.3 23.4,6.3 22.32,5.22 12.42,5.22 10.85,6.79 JP1.5
GP20  (via drill 0.35)  (1 unrouted)
  Top 0.61: 60.96,12.18 60.96,12.66 60.96,13.97 59.69,15.24 45.72,15.24 41.91,19.05 GPIO.5 37.83,19.05 29.76,27.12 29.76,32.52 27.84,34.44 27.84,38 GPIO_H.5 GPIO_M.5 | v59.94,3 59.94,7.02 61.02,8.1 61.02,11.53 | 61.02,11.53 61.02,12.12 | 61.02,12.12 60.96,12.18 | U1.P$26 60.96,12.06 61.02,12.12 | U1.P$26 61.02,11.53 | U1.P$26 60.96,12.18
  Bottom 0.61: JP1.1 5.77,5.45 8.22,3 v59.94,3
GP21  (1 unrouted)
  Top 0.61: GPIO_M.6 GPIO_H.6 30.42,38.04 30.42,35.4 31.2,34.62 31.2,28.44 38.05,21.59 GPIO.6 41.91,21.59 46.99,16.51 62.23,16.51 63.5,15.24 U1.P$27 63.5,10.88 63.42,10.8
  Bottom 0.61: JP1.3 8.31,5.67 9.9,4.08 58.32,4.08 63.5,9.26 U1.27
GP22  (1 unrouted)
  Top 0.61: GPIO_M.7 GPIO_H.7 32.82,37.9 32.82,29.16 37.85,24.13 GPIO.7 41.91,24.13 48.26,17.78 66.04,17.78 68.58,15.24 U1.P$29
GP26
  Top 0.61: GPIO.8 39.34,26.7 37.44,26.7 34.48,29.66 34.48,34.5 35.56,35.58 GPIO_H.8 GPIO_M.8 | U1.P$31 U1.31
  Bottom 0.61: U1.31 73.66,15.24 71.12,17.78 45.72,17.78 41.91,21.59 41.91,25.4 40.64,26.67 GPIO.8
GP27
  Top 0.61: GPIO.9 36.79,29.21 35.76,30.24 35.76,32.76 38.1,35.1 GPIO_H.9 GPIO_M.9 | U1.P$32 U1.32
  Bottom 0.61: U1.32 76.2,16.51 73.66,19.05 46.99,19.05 43.18,22.86 43.18,27.94 41.91,29.21 GPIO.9
GP28  (1 unrouted)
  Top 0.61: GPIO_M.10 GPIO_H.10 40.64,35.4 39.38,34.14 39.38,32.42 39.37,32.41 GPIO.10 40.64,31.75 41.91,30.48 41.91,26.67 49.53,19.05 75.8,19.05 81.28,13.57 U1.P$34
L_RESET
  Top 0.61: JP1.4 8.31,21.03 4.82,24.52 U2.4
MISO
  Top 0.61: JP1.8 13.39,13.03 11.89,14.53 11.89,22.15 14.26,24.52 U2.13
MOSI
  Top 0.61: JP1.6 10.55,11.53 10.55,23.45 13.62,26.52 U2.14
N$1
  Top 0.61: S1.1 63.61,77.38 BTN_PULL_DOWN.1 64.11,70.13 R1.2
N$2  (via drill 0.35)
  Top 0.61: BTN_PULL_DOWN.2 61.07,76.52 S2.1 | R2.2 v66.91,72.65 v66.9,72.66
  Bottom 0.61: v66.9,72.66 66.66,72.66 65.7,73.62 61.86,73.62 61.07,72.83 BTN_PULL_DOWN.2
N$3
  Top 0.61: S3.1 58.53,73.36 BTN_PULL_DOWN.3 58.53,69.87 56.28,67.62 52.38,67.62 50.93,69.07 R3.2
N$4
  Top 0.61: S4.1 50.62,78.92 51,78.54 51,75.62 BTN_PULL_DOWN.4 53.39,70.63 51.96,72.06 49.06,72.06 R4.2
N$5
  Top 0.61: S5.1 71.12,7.01 U1.P$30 U1.30
N$6
  Top 0.61: LED2.A 13.08,42.51 13.08,43.98 16.32,47.22 22.26,47.22 29.47,54.43 LEDS.2
N$7
  Top 0.61: LED3.A 15.42,48.66 21.24,48.66 26.93,54.35 LEDS.3
N$8
  Top 0.61: R5.2 LED1.C
N$9
  Top 0.61: R6.2 LED2.C
N$10
  Top 0.61: R7.2 LED3.C
N$11
  Top 0.61: R8.2 LED4.C
N$12
  Top 0.61: R9.2 LED5.C
N$13
  Top 0.61: R10.2 LED6.C
N$14
  Top 0.61: LED6.A 19.13,55.88 LEDS.6
N$15  (via drill 0.35)
  Top 0.61: LED1.A 13.5,39.12 v13.56,39.12
  Bottom 0.61: v13.56,39.12 13.56,49.02 15.78,51.24 30.54,51.24 32.01,52.71 LEDS.1
N$16
  Top 0.61: LED4.A 13.19,50.24 20.3,50.24 24.39,54.33 LEDS.4
N$17
  Top 0.61: LED5.A 20.27,52.07 21.85,53.65 LEDS.5
NSS
  Top 0.61: U2.15 20.02,28.52 20.94,27.6 20.94,15.24 18.47,12.77 JP1.12
RX
  Top 0.61: PHD_BLUETOOTH.5 60.12,96.51 60.12,92.94 56.46,89.28 47.46,89.28 44.46,86.28 44.46,66.42 49.33,61.55 BLUETOOTH.1
SCK
  Top 0.61: JP1.10 15.93,13.41 13.08,16.26 13.08,21.66 13.94,22.52 U2.12
SCL
  Top 0.61: I2C_JP.2 I2C_JP.4 I2C_JP.6 I2C_JP.8 I2C_JP.10 I2C_JP.12 I2C_JP.14 79.38,60.01 I2C_JP.16 I2C_DEFAULT.2
SDA
  Top 0.61: I2C_JP.1 I2C_JP.3 I2C_JP.5 I2C_JP.7 I2C_JP.9 I2C_JP.11 I2C_JP.13 I2C_JP.15 I2C_DEFAULT.1
SEL3V3
  Top 0.61: SOURCE_JP3V3.1 SOURCE_JP3V3.3 SOURCE_JP3V3.5 SOURCE_JP3V3.7 SOURCE_JP3V3.9 SOURCE_JP3V3.11 SOURCE_JP3V3.13 SOURCE_JP3V3.15 78.78,69.65 78.78,80.82 77.7,81.9 S6.5 S6.2 67.44,81.9 65.09,84.25 S1.2 S2.2 S3.2 52.97,85.22 S4.2
TX
  Top 0.61: BLUETOOTH.2 42.06,65.45 42.06,85.98 46.92,90.84 54.9,90.84 57.55,93.49 PHD_BLUETOOTH.4
VBUS  (via drill 0.35)
  Top 0.61: SOURCE_VCCJP.15 39.02,56.38 v36.06,59.34 | U1.P$40 U1.40
  Bottom 0.61: SOURCE_VCCJP.15 SOURCE_VCCJP.13 SOURCE_VCCJP.11 SOURCE_VCCJP.9 SOURCE_VCCJP.7 SOURCE_VCCJP.5 SOURCE_VCCJP.3 SOURCE_VCCJP.1 | U$1.7 U$1.8 78.13,95.39 78.13,91.81 76.32,90 71.34,90 68.89,92.45 X1.1 61.15,88.38 39.6,88.38 | U1.40 96.52,16.7 92.58,20.64 51.06,20.64 44.7,27 44.7,46.56 36.06,55.2 v36.06,59.34 36.06,84.84 39.6,88.38 | 39.6,88.38 42.36,91.14 51.24,91.14 52.47,92.37 PHD_BLUETOOTH.2
VCC3V3  (via drill 0.35)  (1 unrouted)
  Top 0.61: v75.72,76.44 75.72,78.93 S6.6 | U2.3 8.4,26.52 14.94,33.06 14.94,43.86 16.74,45.66 25.92,45.66 34.74,54.48 73.92,54.48 v75.72,52.68 77.52,50.88 95.22,50.88 98.04,48.06 98.04,18.96 96.78,17.7 87.78,17.7 86.36,16.28 U1.P$36
  Top 0.813: S6.3 S6.6
  Bottom 0.61: 86.52,12.54 U1.36 | v75.72,52.68 v75.72,76.44
VSYS
  Top 0.61: U1.P$39 U1.39

### Text on the board
tNames: BTN1 | BTN4 | 3v3 | GND | SDA | SCL | VBUS | GND | LED6 | LED5 | LED4 | LED3 | LED2 | LED1 | GP16 | GP17 | GP18 | GP19 | GP20 | GP21 | GP22 | GP26 | GP27 | GP28 | GP15 | GP14 | GP13 | GP12 | GP11 | GP10 | GP9 | GP8 | GP7 | GP6 | GP5 | GP4 | GP3 | GP2 | GP1 | GP0 | GP28 | GP27 | GP26 | GP22 | GP21 | GP20 | GP19 | GP18 | GP17 | GP16 | DIO0 | RESET | MOSI | MISO | SCK | NSS
tValues: L298N | TX_BT | RX_BT | GP0 | GP1